# Altium schematic sheet Phase Lock Loop.schdoc: Phase Lock Loop
size A4; Organization: Altium Limited; Address1: L3, 12a Rodborough Rd; Address2: Frenchs Forest; Address3: NSW; Address4: Australia 2086; DocumentNumber: 1; SheetNumber: 1; SheetTotal: 1
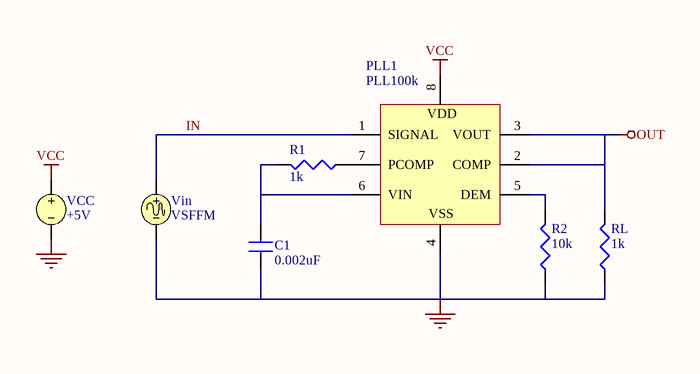
[diagram p0: Phase Lock Loop.schdoc]

## Parts
C1  0.002uF
PLL1  PLL100k
R1  1k
R2  10k
RL  1k
VCC  +5V
Vin  VSFFM

## Nets
GND: C1.2 PLL1.4(VSS) R2.2(BOT) RL.2(BOT) VCC.2 Vin.2
OUT: PLL1.2(COMP) PLL1.3(VOUT) RL.1(TOP)
VCC: PLL1.8(VDD) VCC.1
IN: PLL1.1(SIGNAL) Vin.1
NetC1_1: C1.1 PLL1.6(VIN) R1.1(TOP)
NetPLL1_5: PLL1.5(DEM) R2.1(TOP)
NetPLL1_7: PLL1.7(PCOMP) R1.2(BOT)

## Notes on the sheet
- Title
- Size:
- Date:
- A4
- Number:
- Time:
- Revision:
- Sheet
- of
- File:

## Library data of the parts
C1 = CAP: Capacitor; Value: 0.002uF
PLL1 = PLL100k: Generic Phase Locked Loop
R1 R2 RL = RES: Resistor
  R1 RL: Value: 1k
  R2: Value: 10k
VCC = VSRC: Voltage Source; Value: +5V
Vin = VSFFM: Frequency-Modulated Sinusoidal Voltage Source